# EAGLE schematic ECT_RADIATOR_FAN_CIRCUIT for Launchpad (EAGLE 8.1.0)
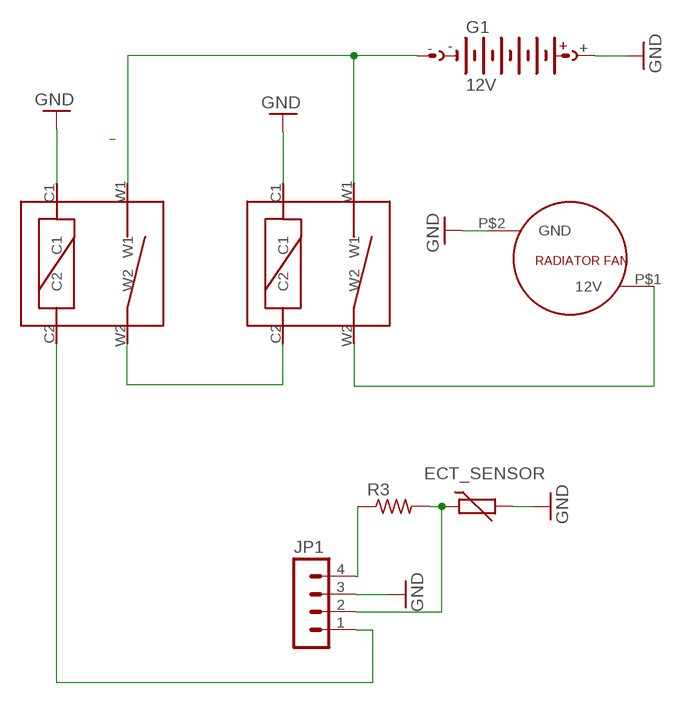
[diagram p0: schematic, sheet 1]

## Parts
3.3V,10A  3.3V, 10A  RELAY_AUTO  [RELAY_AUTO]
12V,30A  12V, 30A  RELAY_AUTO  [RELAY_AUTO]
ECT_SENSOR  THERMISTOR-5  [R-5]
G1  12V  AB9V  [AB9V]
JP1  MA04-1  [MA04-1]
R3  R-US_0207/7  [0207/7]
U$4  FAN  [FAN]

## Nets
GND: 3.3V,10A.C1 12V,30A.C1 ECT_SENSOR.2 G1.+ JP1.3 U$4.P$2(GND)
N$1: ECT_SENSOR.1 JP1.2 R3.2
N$2: JP1.4 R3.1
N$3: 12V,30A.W2 U$4.P$1(12V)
N$5: 3.3V,10A.C2 JP1.1
N$6: 3.3V,10A.W2 12V,30A.C2
N$7: 3.3V,10A.W1 12V,30A.W1 G1.-

## Library data of the parts
3.3V,10A 12V,30A = relay_auto:RELAY_AUTO
ECT_SENSOR = varistor:THERMISTOR: THERMISTOR
G1 = battery:AB9V: 9-V BATTERY CLIP
JP1 = con-lstb:MA04-1: PIN HEADER; OC_FARNELL: unknown; OC_NEWARK: unknown
R3 = resistor:R-US_: RESISTOR, American symbol
U$4 = RADIATOR FAN:FAN